# Altium schematic sheet Power_In_PCDuino.SchDoc
size Letter
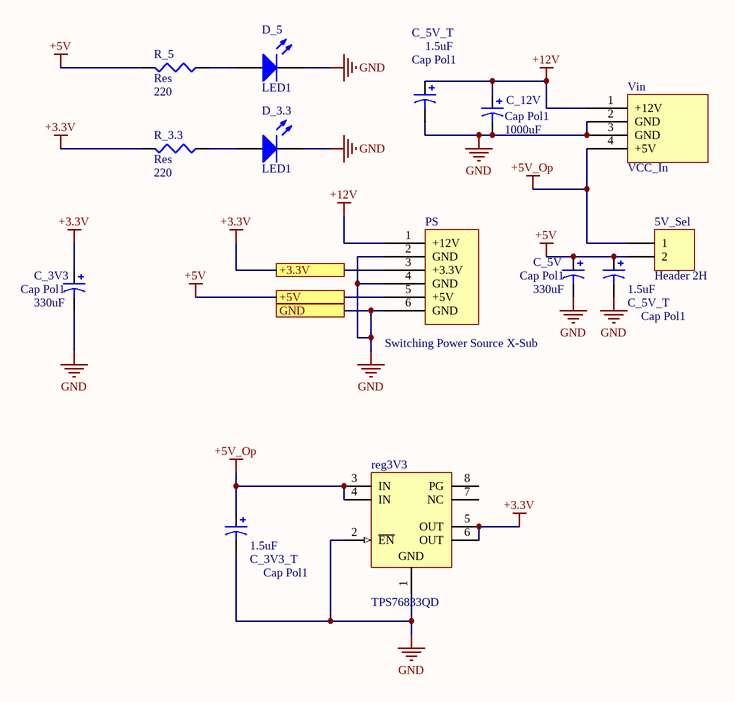
[diagram p0: Power_In_PCDuino.SchDoc]

## Parts
(Parts that share a designator on the sheet are numbered #1, #2 ... from top to bottom, then left to right.)
5V_Sel  Header 2H  [HDR1X2H]
C_3V3  Cap Pol1  value 330uF  [C Panasonic Size Cap Pol]
C_3V3_T  Cap Pol1  value 1.5uF  [6-0805_L]
C_5V  Cap Pol1  value 330uF  [C Panasonic Size Cap Pol]
C_5V_T#1  Cap Pol1  value 1.5uF  [6-0805_L]
C_5V_T#2  Cap Pol1  value 1.5uF  [6-0805_L]
C_12V  Cap Pol1  value 1000uF  [C Panasonic Size Cap Pol]
D_3.3  LED1  [LED-1]
D_5  LED1  [LED-1]
PS  Switching Power Source X-Sub  [Fuente_Switching]
R_3.3  Res  value 220  [J1-0603]
R_5  Res  value 220  [J1-0603]
reg3V3  TPS76833QD  [TI-D8_N]
Vin  VCC_In  [Vcc_In]

## Ports
+3.3V, +5V, GND

## Nets
+3.3V: C_3V3.1 PS.3(+3.3V) R_3.3.2 reg3V3.5(OUT) reg3V3.6(OUT) ; port +3.3V
+5V: 5V_Sel.2 C_5V.1 C_5V_T#2.1 PS.5(+5V) R_5.2 ; port +5V
+5V_Op: 5V_Sel.1 C_3V3_T.1 reg3V3.3(IN) reg3V3.4(IN) Vin.4(+5V)
+12V: C_5V_T#1.1 C_12V.1 PS.1(+12V) Vin.1(+12V)
GND: C_3V3.2 C_3V3_T.2 C_5V.2 C_5V_T#1.2 C_5V_T#2.2 C_12V.2 D_3.3.2(K) D_5.2(K) PS.2(GND) PS.4(GND) PS.6(GND) reg3V3.1(GND) reg3V3.2(~{EN}) Vin.2(GND) Vin.3(GND) ; port GND
NetD_3.3_1: D_3.3.1(A) R_3.3.1
NetD_5_1: D_5.1(A) R_5.1

Not connected (* = marked no-connect by the designer): reg3V3 7(NC) 8(PG)

## Library data of the parts
5V_Sel = Header 2H: Header, 2-Pin, Right Angle; LatestRevisionDate: 17-Jul-2002; LatestRevisionNote: Re-released for DXP Platform.; Publisher: Altium Limited
C_3V3 C_5V C_12V = Cap Pol1: Polarized Capacitor (Radial); Published: 8-Jun-2000; LatestRevisionDate: 17-Jul-2002; LatestRevisionNote: Re-released for DXP Platform.; PackageReference: RB7.6-15; Publisher: Altium Limited; PackageDescription: Polarized Capacitor (Radial); 2 Leads
C_3V3_T C_5V_T#1 C_5V_T#2 = Cap Pol1: Tantalum; Published: 8-Jun-2000; LatestRevisionDate: 17-Jul-2002; LatestRevisionNote: Re-released for DXP Platform.; PackageReference: RB7.6-15; Publisher: Altium Limited; PackageDescription: Polarized Capacitor (Radial); 2 Leads
D_3.3 D_5 = LED1: Typical RED GaAs LED; Published: 8-Jun-2000; LatestRevisionDate: 08-Jul-2005; LatestRevisionNote: Mech Layer 1 removed.; PackageReference: LED-1; Publisher: Altium Limited; PackageDescription: LED; 2 Leads
R_3.3 R_5 = Res3: Resistor; Published: 8-Jun-2000; LatestRevisionDate: 29-May-2009; LatestRevisionNote: IPC-7351 Footprint Added.; PackageReference: J1-0603; Publisher: Altium Limited; PackageDescription: Chip Resistor
reg3V3 = TPS76833QD: Single Output Fast Transient Response LDO, 1 A, Fixed 3.3 V Output, 2.7 to 10 V Input, with Low IQ, 8-pin SOIC (D), -40 to 125 degC, Green (RoHS & no Sb/Br); Manufacturer: Texas Instruments; Accuracy(%): 2; Fixed Output Options(V): 3.3; Iout(Max)(A): 1; Iq(Typ)(mA): 0.08; Power Good: TRUE; SubFamily: Single Channel LDO; Vdo(Typ)(mV): 350; Vin(Max)(V): 10; Vin(Min)(V): 2.7; DatasheetVersion: SLVS211L; PackageVersion: 4040047-3/M; PackageReference: D8; PackageDescription: 8-Pin Plastic Small Outline, Body 4.9 x 3.9 mm, Pitch 1.27 mm; Supplier 1: Digi-Key; Supplier Part Number 1: 296-2750-5-ND; Supplier 2: Farnell; Supplier Part Number 2: 8461481; Supplier 3: Newark; Supplier Part Number 3: 77C1133; Supplier 4: Mouser; Supplier Part Number 4: 595-TPS76833QD; Eco-Plan: Green (RoHS & no Sb/Br); Vout Adj(Max)(V): 3.3; Vout Adj(Min)(V): 3.3; Mounting Technology: Surface Mount; Code_JEDEC: MS-012; PartNumber: TPS76833QD; ComponentLink1Description: Manufacturer URL; ComponentLink1URL: http://www.ti.com/; ComponentLink2Description: Datasheet; ComponentLink2URL: http://www.ti.com/general/docs/lit/getliterature.tsp?genericPartNumber=TPS76833&fileType=pdf; ComponentLink3Description: Package Specification; ComponentLink3URL: http://www.ti.com/litv/pdf/msoi002j
Vin = VCC_In: pin to pad: 1>0 2>1 3>2 4>3